# EasyEDA Pro project stm32g474.epro

# Schematic Schematic1
Assembly Variant: Basic; Board Name: Board1; Create Date: 2025-12-02; Page Name: P1; Project Name: New Project_2025-12-02_14-17-57; Schematic Name: Schematic1; Update Date: 2025-12-02; BladeWidth: 10; Company: 嘉立创EDA; Page Size: A4; RegionStart: 1; ShowBorder: 1; TitleBlock: 1; TitleBlockPosition: 3; Version: V1.0; XRegionCount: 6; YRegionCount: 4
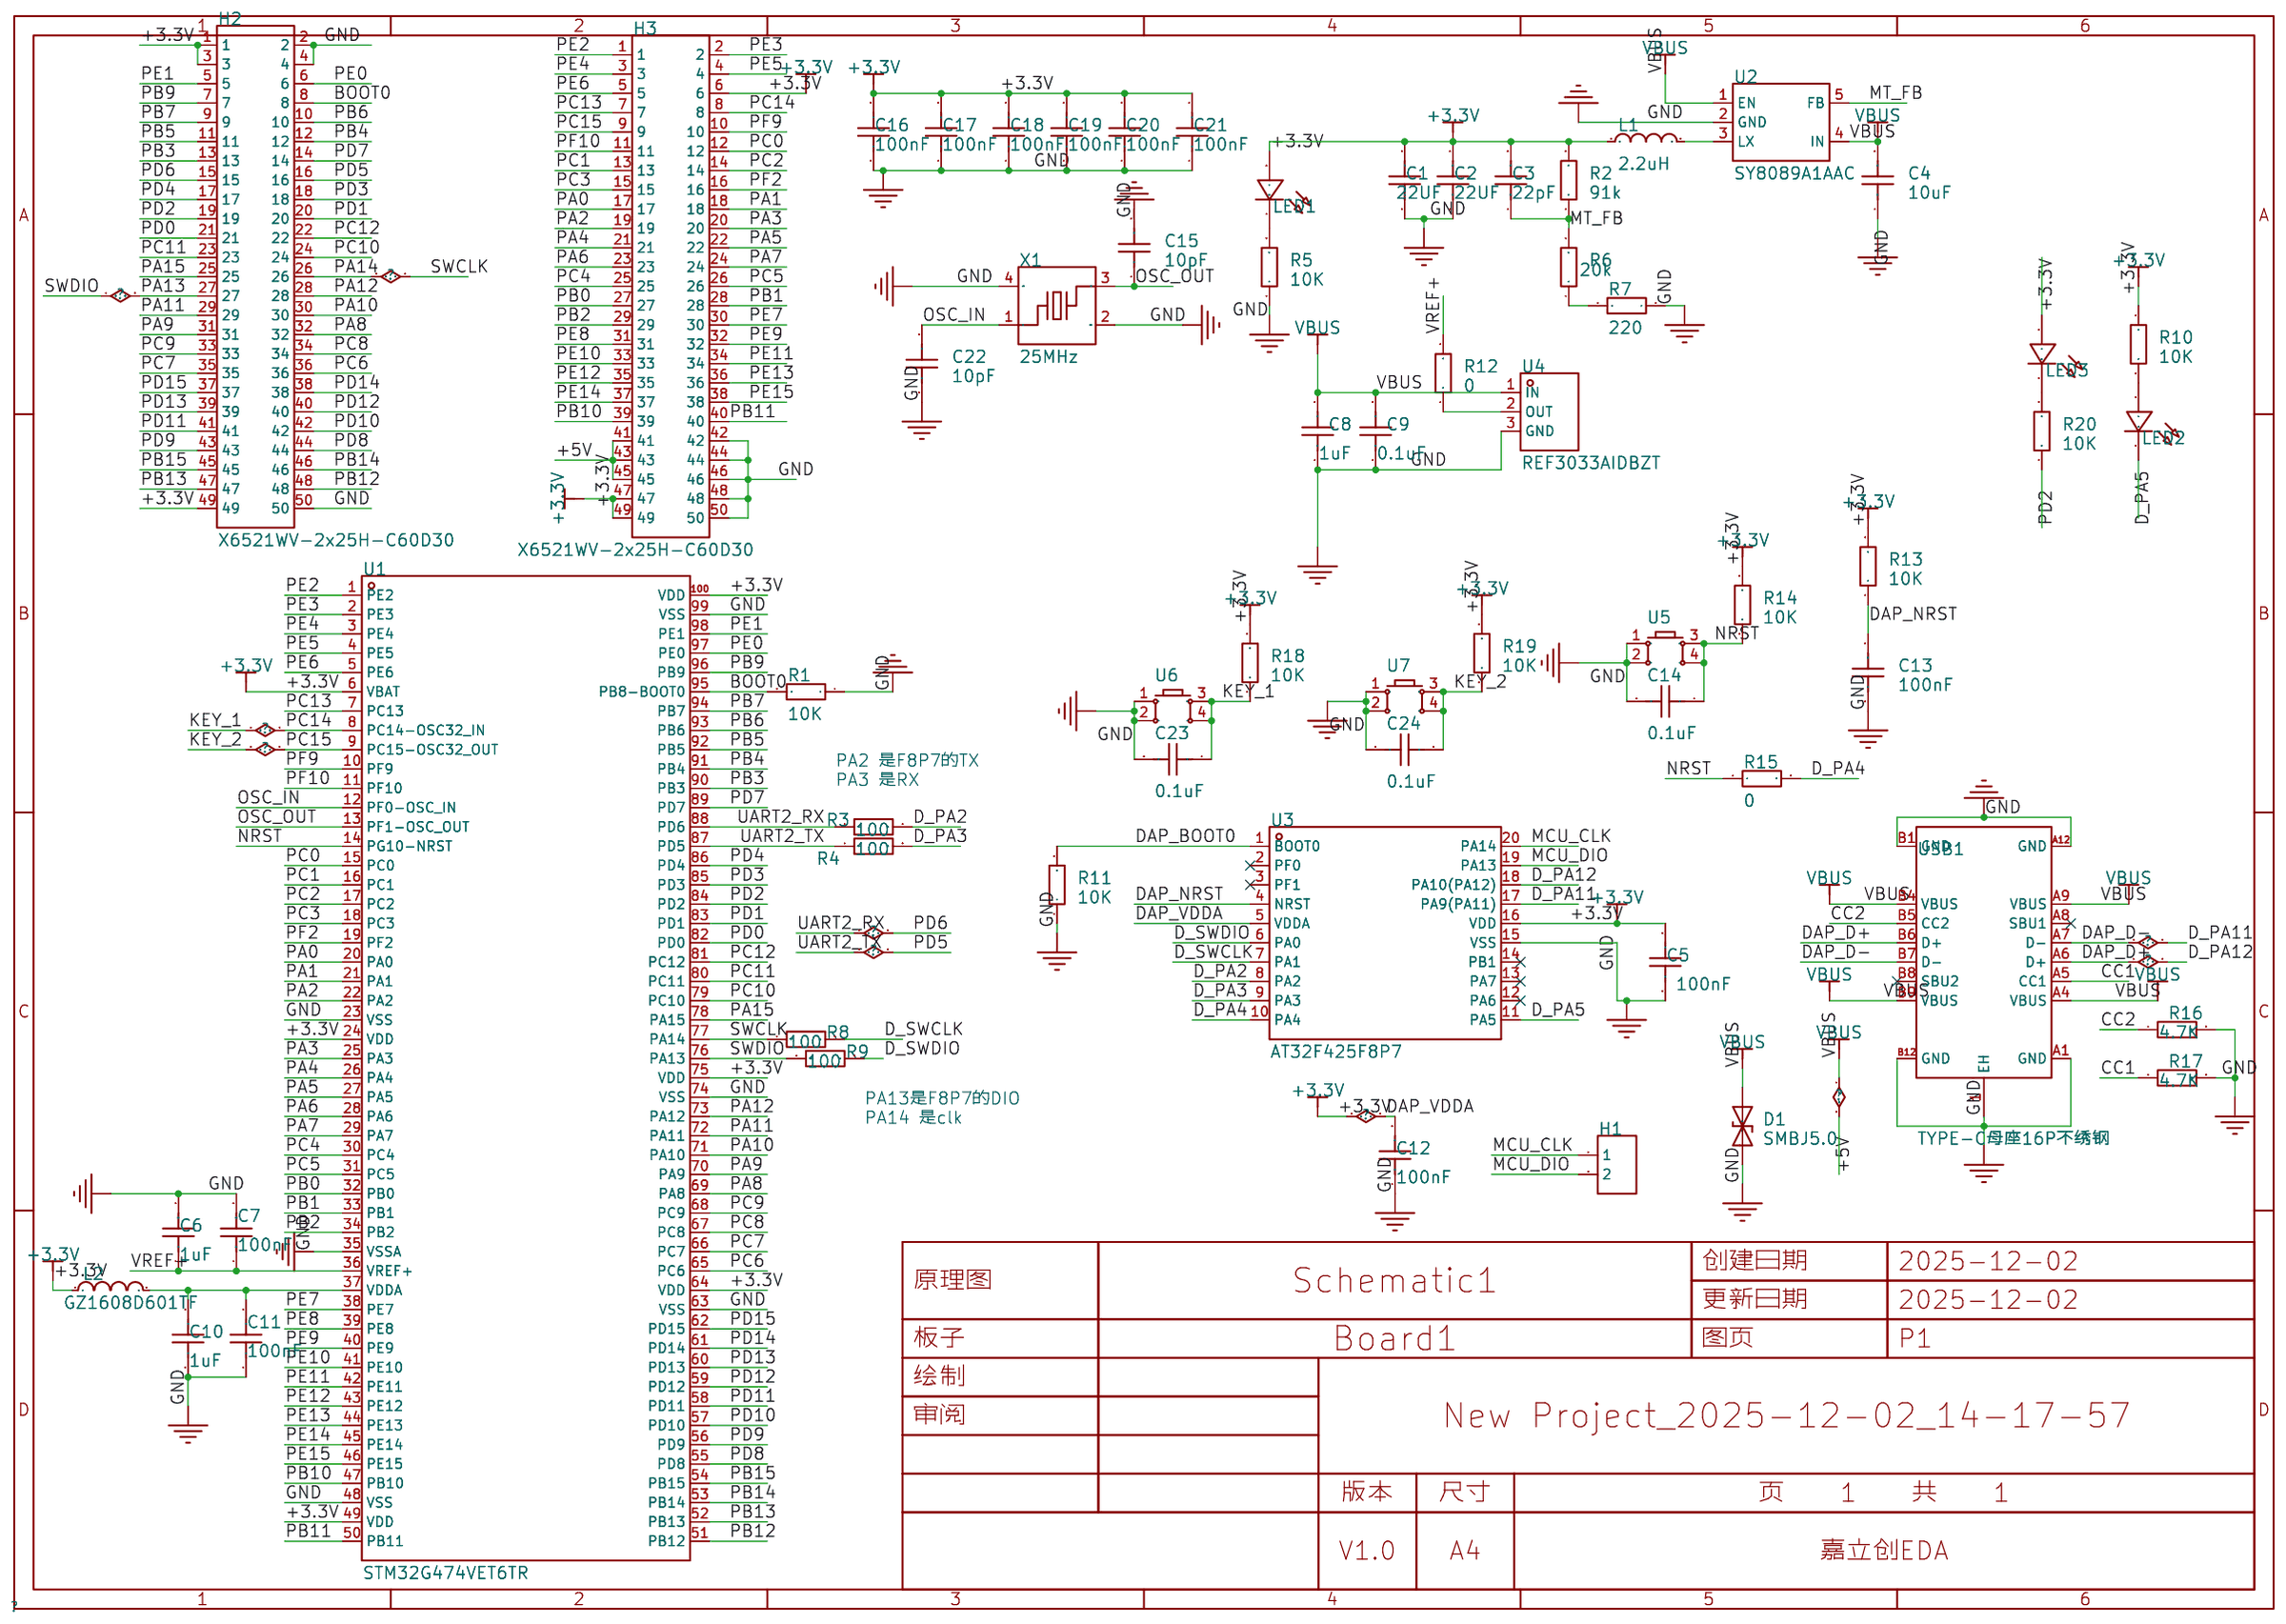
[diagram p0: schematic sheet]

## Parts
C1  22UF  [C0603_1]
C2  22UF  [C0603_1]
C3  22pF  [C0603_1]
C4  10uF  [C0603_1]
C5  100nF  [C0603_1]
C6  1uF  [C0603_1]
C7  100nF  [C0603_1]
C8  1uF  [C0603_1]
C9  0.1uF  [C0603_1]
C10  1uF  [C0603_1]
C11  100nF  [C0603_1]
C12  100nF  [C0603_1]
C13  100nF  [C0603_1]
C14  0.1uF  [C0603_1]
C15  10pF  [C0603_1]
C16  100nF  [C0603_1]
C17  100nF  [C0603_1]
C18  100nF  [C0603_1]
C19  100nF  [C0603_1]
C20  100nF  [C0603_1]
C21  100nF  [C0603_1]
C22  10pF  [C0603_1]
C23  0.1uF  [C0603_1]
C24  0.1uF  [C0603_1]
D1  SMBJ5.0  [SMB_L4.3-W3.6-LS5.4-BI]
H1  -  [HDR-TH_2P-P2.54-V-F]
H2  X6521WV-2x25H-C60D30  [HDR-TH_50P-2.54-V-M-R2-C25-S2.54]
H3  X6521WV-2x25H-C60D30  [HDR-TH_50P-2.54-V-M-R2-C25-S2.54]
L1  2.2uH  [IND-SMD_L2.5-W2.0_MHCHL2520]
L2  GZ1608D601TF  [L0603]
LED1  -  [LED_0603]
LED2  -  [LED_0603]
LED3  -  [LED_0603]
R1  10K  [R0603_1]
R2  91k  [R0603_1]
R3  100  [R0603_1]
R4  100  [R0603_1]
R5  10K  [R0603_1]
R6  20k  [R0603_1]
R7  220  [R0603_1]
R8  100  [R0603_1]
R9  100  [R0603_1]
R10  10K  [R0603_1]
R11  10K  [R0603_1]
R12  0  [R0603_1]
R13  10K  [R0603_1]
R14  10K  [R0603_1]
R15  0  [R0603_1]
R16  4.7K  [R0603_1]
R17  4.7K  [R0603_1]
R18  10K  [R0603_1]
R19  10K  [R0603_1]
R20  10K  [R0603_1]
U1  STM32G474VET6TR  [LQFP-100_L14.0-W14.0-P0.50-LS16.0-TL]
U2  SY8089A1AAC  [TSOT-23-5_L2.9-W1.6-P0.95-LS2.8-BR]
U3  AT32F425F8P7  [TSSOP-20_L6.5-W4.4-P0.65-LS6.4-BL]
U4  REF3033AIDBZT  [SOT-23-3_L2.9-W1.3-P1.90-LS2.4-BR_1]
U5  -  [SW-SMD_4P-L4.2-W3.4-P2.15-LS5.2]
U6  -  [SW-SMD_4P-L4.2-W3.4-P2.15-LS5.2]
U7  -  [SW-SMD_4P-L4.2-W3.4-P2.15-LS5.2]
USB1  TYPE-C母座16P不绣钢  [TYPE-C-SMD_16P-EH4]
X1  25MHz  [CRYSTAL-SMD_4P-L3.2-W2.5-BL]

## Library data of the parts
C1-C24 = CAP_0603: Supplier Footprint: 0603
D1 = SMBJ5.0: 反向截止电压(Vrwm):5V;钳位电压:9.6V;峰值脉冲电流(Ipp):62.5A;峰值脉冲功率(Ppp):600W;击穿电压:6.4V;; LCSC Part Name: TVS 5V截止 62.5A峰值脉冲; Supplier Part: C3699966; Manufacturer: Meritek; Supplier Footprint: DO-214AA(SMB); Datasheet: https://atta.szlcsc.com/upload/public/pdf/source/20240124/F48BA0542F6F34AEB83E4D8FD697F3E7.pdf; Supplier: LCSC; Reverse Stand-Off Voltage (Vrwm): 5V; Clamping Voltage: 9.6V; Peak Pulse Current (Ipp): 62.5A; Peak Pulse Power Dissipation (Ppp): 600W; Voltage - Breakdown: 6.4V; Type: TVS
H1 = HDR-F_2.54_1x2P: Supplier Part: C49661; Supplier Footprint: 插件
H2 H3 = X6521WV-2x25H-C60D30: 插针结构:2x25P;间距:2.54mm;行距:2.54mm;圆针/方针:方针;排数:双排;总PIN位数:50P;额定电流:3A;额定电压:250V;配合针长度:-;塑高:2.5mm;端接针长度:-;触头材质:黄铜;触头镀层:金;工作温度:-40℃~+105℃;颜色:黑色;; LCSC Part Name: 2x25P 间距:2.54mm 方针; Supplier Part: C725897; Manufacturer: XKB Connection(中国星坤); Supplier Footprint: 插件,P=2.54mm; JLCPCB Part Class: 扩展库; Datasheet: https://item.szlcsc.com/datasheet/X6521WV-2x25H-C60D30/772346.html; Supplier: LCSC; Pin Structure: 2x25P; Pitch: 2.54mm; Row Spacing: 2.54mm; Circluar Pins/Square Pins: 方针; Number of Rows: 双排; Number of Pins: 50P; Current Rating: 3A; Voltage Rating (Max): 250V; Insulation Height: 2.5mm; Contact Material: 黄铜; Contact Plating: 金; Operating Temperature: -40℃~+105℃; Color: 黑色
L1 = FTC252012S2R2MBCA: 电感值:2.2uH;精度:±20%;额定电流:3A;饱和电流(Isat):3.8A;类型:一体成型电感;; LCSC Part Name: 2.2uH ±20% 3.8A; Supplier Part: C5832372; Manufacturer: cjiang(长江微电); Supplier Footprint: 1008; JLCPCB Part Class: 扩展库; Datasheet: https://atta.szlcsc.com/upload/public/pdf/source/20230602/8FFEDA9C0247A92A0D4B67554BFE4091.pdf; Supplier: LCSC; Tolerance: ±20%; Rated Current: 3A; Saturation Current (Isat): 3.8A; DC Resistance (DCR): 55mΩ; Type: 一体成型电感
L2 = GZ1608D601TF: 阻抗 @ 频率:600Ω@100MHz;误差:±25%;直流电阻(DCR):450mΩ;; LCSC Part Name: 单路 0603磁珠 阻抗600Ω@100MHz; Supplier Part: C1002; Manufacturer: Sunlord(顺络); Supplier Footprint: 0603; JLCPCB Part Class: 基础库; Datasheet: https://atta.szlcsc.com/upload/public/pdf/source/20241120/893429B990C3BA07384E734821D2F218.pdf; Supplier: LCSC; Impedance @ Frequency: 600Ω@100MHz; Tolerance: ±25%; DC Resistance: 450mΩ; Current Rating: 200mA; Circuits: 1
LED1-LED3 = LED_0603-R: Supplier Footprint: 0603
R1-R20 = Res_0603: Supplier Footprint: 0603
U1 = STM32G474VET6TR: CPU内核:ARM-M系列;CPU最大主频:170MHz;应用领域:-;; LCSC Part Name: 带DSP和FPU的170MHz主流ARM Cortex-M4 MCU，具有512 KB Flash存储器、数学加速器、高分辨率定时器和高模拟电平集成; Supplier Part: C1857438; Manufacturer: ST(意法半导体); Supplier Footprint: LQFP-100(14x14); JLCPCB Part Class: 扩展库; Datasheet: https://atta.szlcsc.com/upload/public/pdf/source/20210601/070C5CED5EB45737871E6667B39F1293.pdf; Supplier: LCSC; CPU Core: ARM-M系列; CPU Maximum Speed: 170MHz; Program Storage Size: 512KB; Program Memory Type: FLASH; Number of I/O: 86; ADC (Bit): 12bit; DAC (Bit): 12bit; Voltage - Supply: 1.71V~3.6V
U2 = SY8089A1AAC: 功能类型:降压型;工作电压:2.5V~5.5V;输出电压:-;输出电流:2A;输出类型:可调;; LCSC Part Name: 高效1.5MHz 2A同步降压调节器; Supplier Part: C479074; Manufacturer: Silergy(矽力杰); Supplier Footprint: SOT-23-5; JLCPCB Part Class: 扩展库; Datasheet: https://item.szlcsc.com/datasheet/SY8089A1AAC/486366.html; Supplier: LCSC; Function: 降压型; Voltage - Supply: 2.5V~5.5V; Output Current: 2A; Frequency - Switching: 1.5MHz; Operating Temperature: -40℃~+125℃@(TA/TJ); Synchronous Rectifier: 是; Number of Outputs: 1; Topology: 降压式; Quiescent Current: 50uA; Switch tube (built-in/external): 内置; Output Type: 可调
U3 = AT32F425F8P7: 配有32 K字节到64 K字节闪存、sLib、1个CAN、1个OTGFS、13个定时器、1个ADC、12个通信接口。; LCSC Part Name: 基于ARM 32位Cortex - M4微控制器，配有闪存、sLib、CAN、OTGFS、定时器、ADC、通信接口; Supplier Part: C4153157; Manufacturer: ARTERY(雅特力); Supplier Footprint: TSSOP-20; JLCPCB Part Class: 扩展库; Datasheet: https://item.szlcsc.com/datasheet/AT32F425F8P7/4722606.html; Supplier: LCSC
U4 = REF3033AIDBZT: 输出类型:固定;工作电压:3.35V~5.5V;输出电压:3.3V;输出电流:25mA;精度:±0.2%;; LCSC Part Name: 采用SOT-23-3封装的CMOS电压基准; Supplier Part: C2872391; Manufacturer: TI(德州仪器); Supplier Footprint: SOT-23-3; JLCPCB Part Class: 扩展库; Datasheet: https://www.ti.com/cn/lit/gpn/ref3012; Supplier: LCSC; Output Type: 固定; Voltage - Supply: 3.35V~5.5V; Output Voltage: 3.3V; Output Current: 25mA; Tolerance: ±0.2%; Temperature Coefficient: 75ppm/℃; Reference Type: 串联; Quiescent Current: 42uA; Noise - 1/10Hz to 10Hz: 36uVp-p; Noise - 10Hz to 10kHz: 105uVrms; Operating Temperature: -40℃~+125℃
U5-U7 = Key_SMD_3x4x2.5
USB1 = TYPE-C母座16P不绣钢: Supplier Part: C9900003726; Supplier Footprint: TYPE-C-SMD_16P-L8.94-W7.35-P0.50; JLCPCB Part Class: Extended Part; Supplier: LCSC
X1 = XL2EL89CSI-111YLC-25M: 晶振类型:贴片晶振;频率:25MHz;常温频差:±10ppm;负载电容:20pF;频率稳定度:±20ppm;; LCSC Part Name: YSX321SL 25MHZ 4P 3225 20PF ±10PPM -40~85℃ (±20PPM); Supplier Part: C5280577; Manufacturer: YXC(扬兴晶振); Supplier Footprint: SMD3225-4P; JLCPCB Part Class: 扩展库; Datasheet: https://item.szlcsc.com/datasheet/XL2EL89CSI-111YLC-25M/6016759.html; Supplier: LCSC; Type: 贴片晶振; Normal temperature Frequency Tolerance: ±10ppm; Load Capacitance: 20pF; Frequency Stability: ±20ppm; Operating Temperature: -40℃~+85℃

## Nets
+3.3V: C1.2 C2.2 C3.2 C5.2 C12.2 C16.2 C17.2 C18.2 C19.2 C20.2 C21.2 H2.1 H2.3 H2.49 H3.6 H3.47 H3.49 L1.1 L2.1 LED1.2(A) LED3.2(A) R2.2 R10.1 R13.2 R14.2 R18.2 R19.2 U1.6(VBAT) U1.24(VDD) U1.49(VDD) U1.64(VDD) U1.75(VDD) U1.100(VDD) U3.5(VDDA) U3.16(VDD)
GND: C1.1 C2.1 C4.1 C5.1 C6.2 C7.2 C8.1 C9.1 C10.1 C11.1 C12.1 C13.1 C14.2 C15.2 C16.1 C17.1 C18.1 C19.1 C20.1 C21.1 C22.1 C23.2 C24.2 D1.2(A1) H2.2 H2.4 H2.50 H3.42 H3.44 H3.46 H3.48 H3.50 R1.1 R5.1 R7.1 R11.1 R16.2 R17.2 U1.23(VSS) U1.35(VSSA) U1.48(VSS) U1.63(VSS) U1.74(VSS) U1.99(VSS) U2.2(GND) U3.15(VSS) U4.3(GND) U5.1 U5.2 U6.1 U6.2 U7.1 U7.2 USB1.1(EH) USB1.A1(GND) USB1.A12(GND) USB1.B1(GND) USB1.B12(GND) X1.2(GND) X1.4(GND)
VBUS: C4.2 C8.2 C9.2 D1.1(A2) H3.41 H3.43 H3.45 U2.1(EN) U2.4(IN) U4.1(IN) USB1.A4(VBUS) USB1.A9(VBUS) USB1.B4(VBUS) USB1.B9(VBUS)
BOOT0: H2.8 R1.2 U1.95(PB8-BOOT0)
CC1: R17.1 USB1.A5(CC1)
CC2: R16.1 USB1.B5(CC2)
D_PA2: R3.2 U3.8(PA2)
D_PA3: R4.2 U3.9(PA3)
D_PA4: R15.2 U3.10(PA4)
D_PA5: LED2.1(C) U3.11(PA5)
D_SWCLK: R8.2 U3.7(PA1)
D_SWDIO: R9.2 U3.6(PA0)
DAP_BOOT0: R11.2 U3.1(BOOT0)
DAP_D+: U3.18(PA10(PA12)) USB1.A6(D+) USB1.B6(D+)
DAP_D-: U3.17(PA9(PA11)) USB1.A7(D-) USB1.B7(D-)
DAP_NRST: C13.2 R13.1 U3.4(NRST)
KEY_1: C23.1 H3.8 R18.1 U1.8(PC14-OSC32_IN) U6.3 U6.4
KEY_2: C24.1 H3.9 R19.1 U1.9(PC15-OSC32_OUT) U7.3 U7.4
MCU_CLK: H1.1 U3.20(PA14)
MCU_DIO: H1.2 U3.19(PA13)
MT_FB: C3.1 R2.1 R6.2 U2.5(FB)
NRST: C14.1 R14.1 R15.1 U1.14(PG10-NRST) U5.3 U5.4
OSC_IN: C22.2 U1.12(PF0-OSC_IN) X1.1
OSC_OUT: C15.1 U1.13(PF1-OSC_OUT) X1.3
PA0: H3.17 U1.20(PA0)
PA1: H3.18 U1.21(PA1)
PA2: H3.19 U1.22(PA2)
PA3: H3.20 U1.25(PA3)
PA4: H3.21 U1.26(PA4)
PA5: H3.22 U1.27(PA5)
PA6: H3.23 U1.28(PA6)
PA7: H3.24 U1.29(PA7)
PA8: H2.32 U1.69(PA8)
PA9: H2.31 U1.70(PA9)
PA10: H2.30 U1.71(PA10)
PA11: H2.29 U1.72(PA11)
PA12: H2.28 U1.73(PA12)
PA13: H2.27 R9.1 U1.76(PA13)
PA14: H2.26 R8.1 U1.77(PA14)
PA15: H2.25 U1.78(PA15)
PB0: H3.27 U1.32(PB0)
PB1: H3.28 U1.33(PB1)
PB2: H3.29 U1.34(PB2)
PB3: H2.13 U1.90(PB3)
PB4: H2.12 U1.91(PB4)
PB5: H2.11 U1.92(PB5)
PB6: H2.10 U1.93(PB6)
PB7: H2.9 U1.94(PB7)
PB9: H2.7 U1.96(PB9)
PB10: H3.39 U1.47(PB10)
PB11: H3.40 U1.50(PB11)
PB12: H2.48 U1.51(PB12)
PB13: H2.47 U1.52(PB13)
PB14: H2.46 U1.53(PB14)
PB15: H2.45 U1.54(PB15)
PC0: H3.12 U1.15(PC0)
PC1: H3.13 U1.16(PC1)
PC2: H3.14 U1.17(PC2)
PC3: H3.15 U1.18(PC3)
PC4: H3.25 U1.30(PC4)
PC5: H3.26 U1.31(PC5)
PC6: H2.36 U1.65(PC6)
PC7: H2.35 U1.66(PC7)
PC8: H2.34 U1.67(PC8)
PC9: H2.33 U1.68(PC9)
PC10: H2.24 U1.79(PC10)
PC11: H2.23 U1.80(PC11)
PC12: H2.22 U1.81(PC12)
PC13: H3.7 U1.7(PC13)
PD0: H2.21 U1.82(PD0)
PD1: H2.20 U1.83(PD1)
PD2: H2.19 R20.1 U1.84(PD2)
PD3: H2.18 U1.85(PD3)
PD4: H2.17 U1.86(PD4)
PD5: H2.16 R4.1 U1.87(PD5)
PD6: H2.15 R3.1 U1.88(PD6)
PD7: H2.14 U1.89(PD7)
PD8: H2.44 U1.55(PD8)
PD9: H2.43 U1.56(PD9)
PD10: H2.42 U1.57(PD10)
PD11: H2.41 U1.58(PD11)
PD12: H2.40 U1.59(PD12)
PD13: H2.39 U1.60(PD13)
PD14: H2.38 U1.61(PD14)
PD15: H2.37 U1.62(PD15)
PE0: H2.6 U1.97(PE0)
PE1: H2.5 U1.98(PE1)
PE2: H3.1 U1.1(PE2)
PE3: H3.2 U1.2(PE3)
PE4: H3.3 U1.3(PE4)
PE5: H3.4 U1.4(PE5)
PE6: H3.5 U1.5(PE6)
PE7: H3.30 U1.38(PE7)
PE8: H3.31 U1.39(PE8)
PE9: H3.32 U1.40(PE9)
PE10: H3.33 U1.41(PE10)
PE11: H3.34 U1.42(PE11)
PE12: H3.35 U1.43(PE12)
PE13: H3.36 U1.44(PE13)
PE14: H3.37 U1.45(PE14)
PE15: H3.38 U1.46(PE15)
PF2: H3.16 U1.19(PF2)
PF9: H3.10 U1.10(PF9)
PF10: H3.11 U1.11(PF10)
VREF+: C6.1 C7.1 R12.2 U1.36(VREF+)
$1N1911: LED1.1(C) R5.2
$1N1933: LED2.2(A) R10.2
$1N2083: R12.1 U4.2(OUT)
$1N2090: C10.2 C11.2 L2.2 U1.37(VDDA)
$1N10377: L1.2 U2.3(LX)
$1N10666: R6.1 R7.2
Net-(LED3-1): LED3.1(C) R20.2

Not connected (* = marked no-connect by the designer): U3 2(PF0)* 3(PF1)* 12(PA6)* 13(PA7)* 14(PB1)*; USB1 A8(SBU1)* B8(SBU2)*

## Notes on the sheet
- PA2 是F8P7的TX
  PA3 是RX
- PA13是F8P7的DIO
  PA14 是clk

# Board PCB1
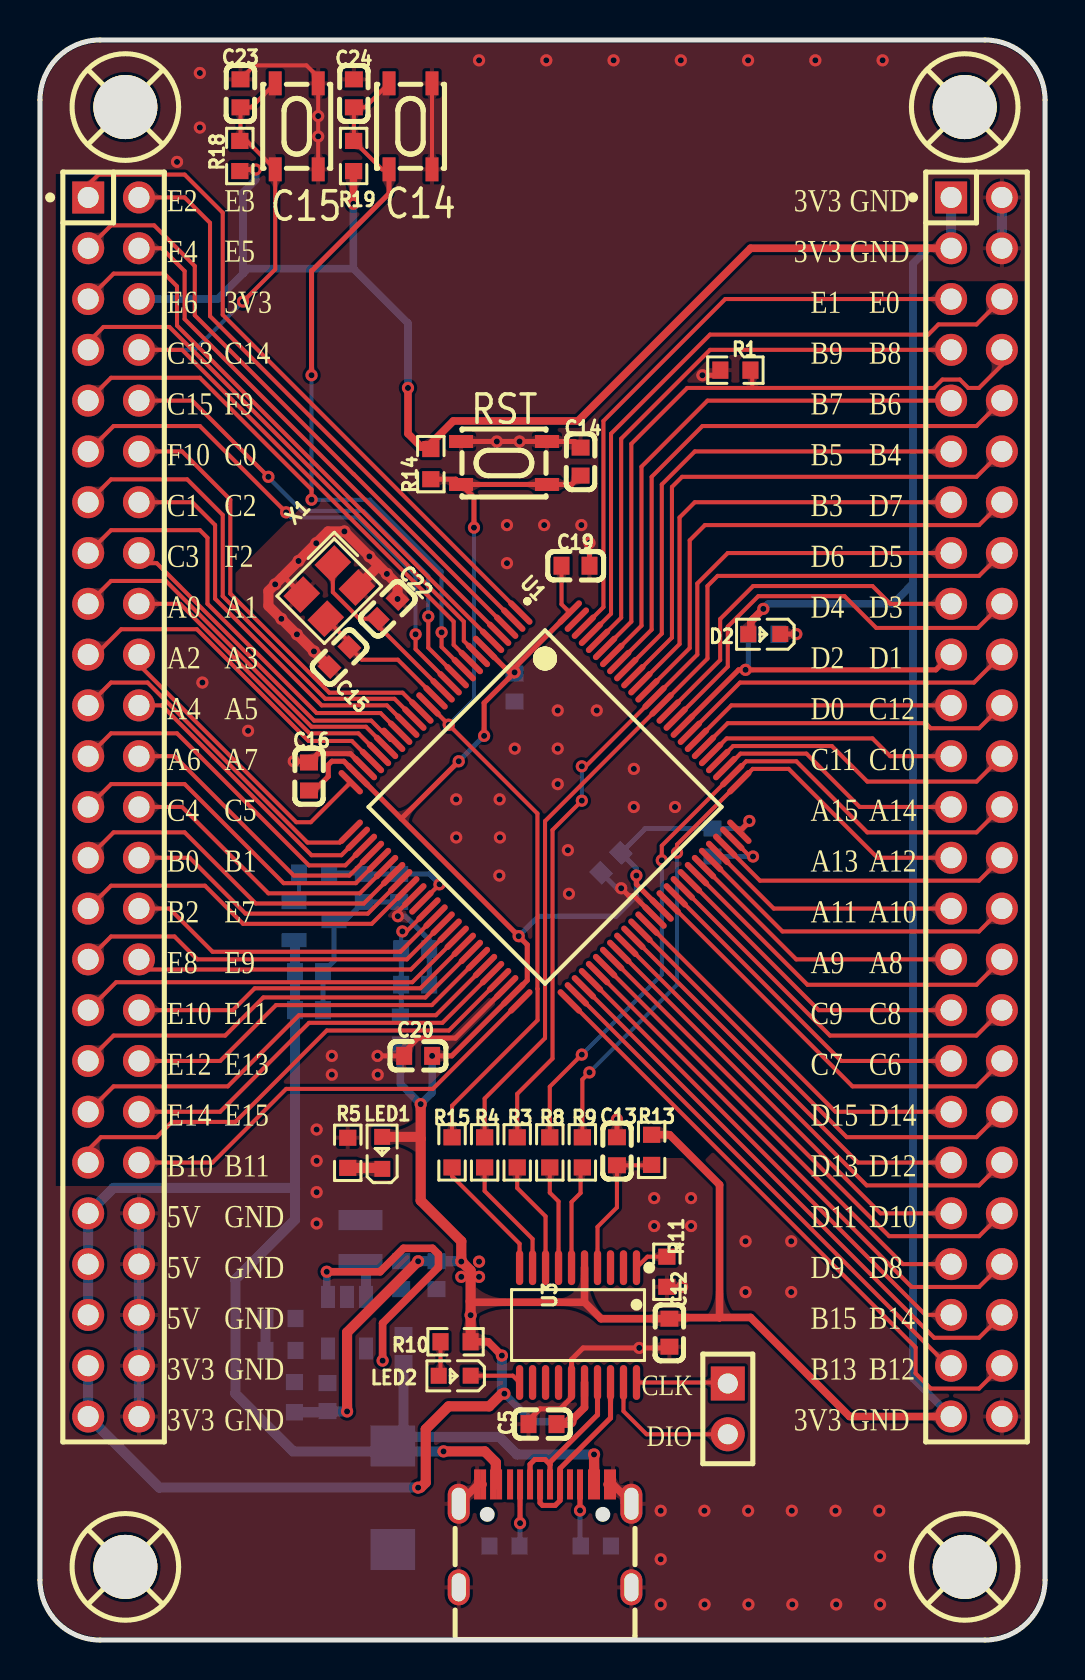
[diagram p1: board, top side]
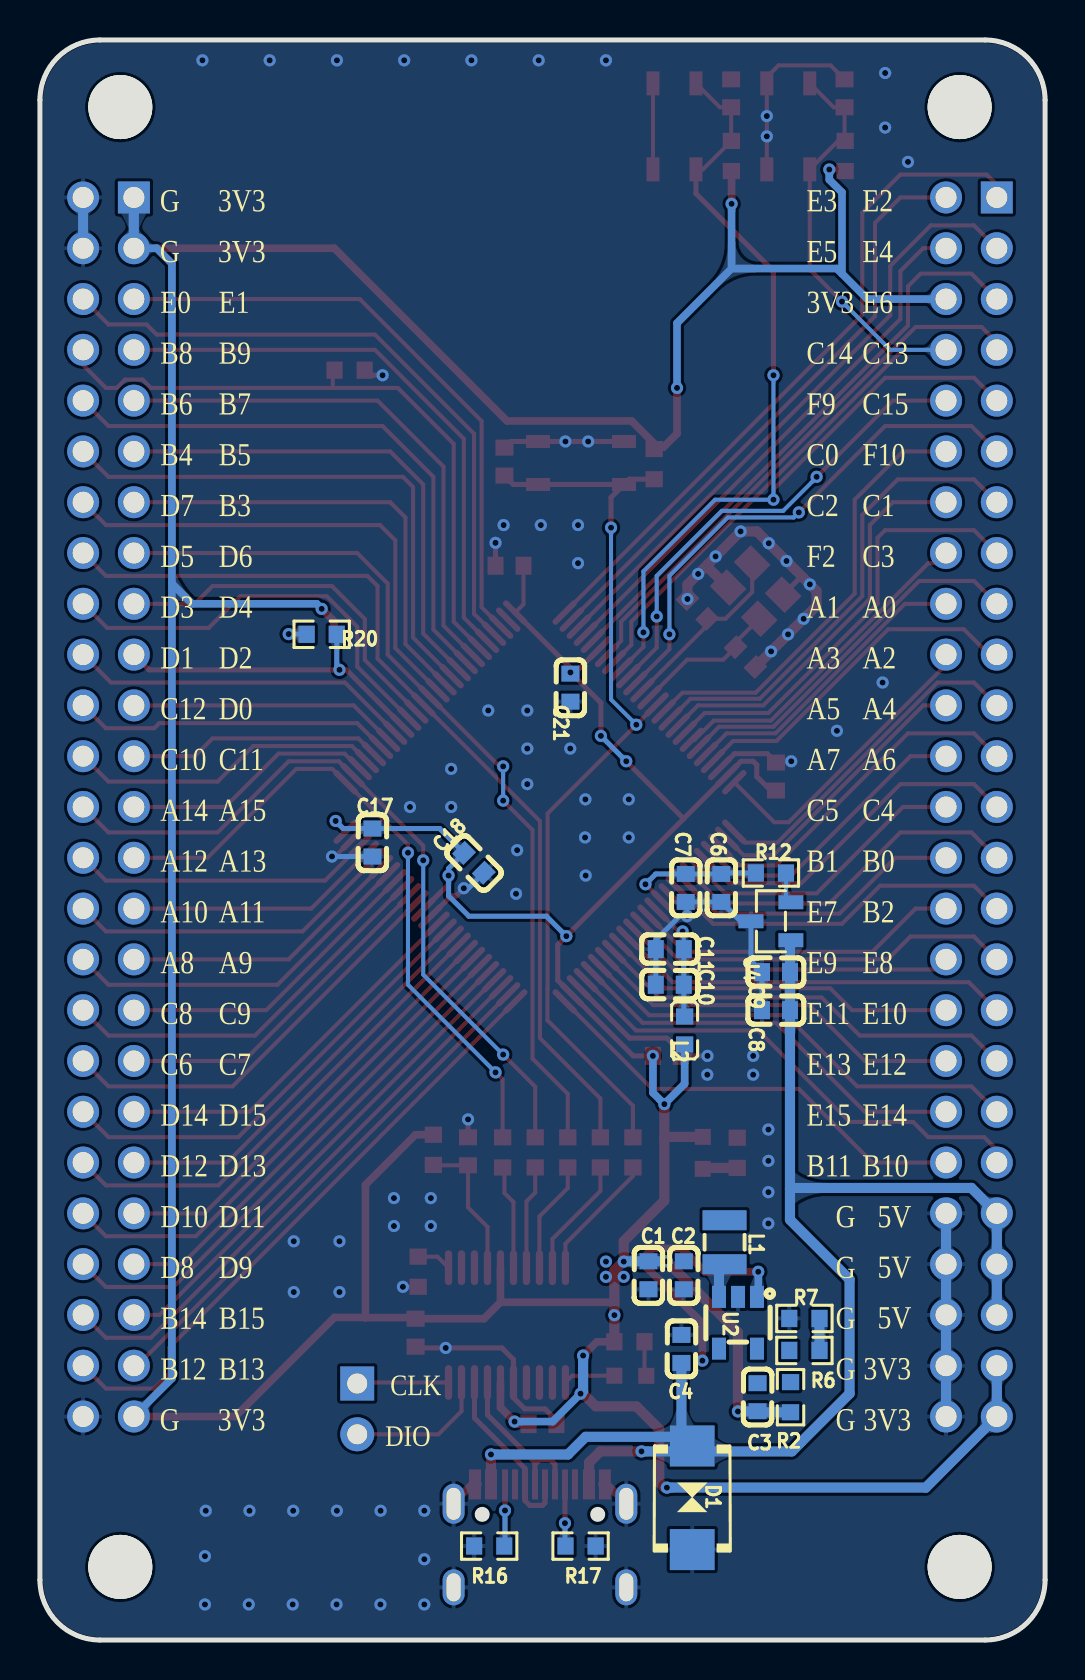
[diagram p2: board, bottom side, seen from below]

Outline 50.29 x 80.01 mm; copper layers: Top Layer, Bottom Layer. Coordinates in mm from the lower left corner of the outline.
Outline path: 0,77.01 0,3 arc(0.88,0.88) 3,0 47.29,0 arc(49.41,0.88) 50.29,3 50.29,77.01 arc(49.41,79.13) 47.29,80.01 3,80.01 arc(0.88,79.13) 0,77.01
Stack: Top Layer 0.035mm / Dielectric1 1.51mm FR4 er 4.5 / Bottom Layer 0.035mm

## Design rules (mm)
spacing copperThickness1oz (default): track to track 0.102, other pairs 0.152 to 0.3
spacing copperThickness2oz: track to track 0.203, other pairs 0.152 to 0.3
track width copperThickness1oz (default): min 0.127, default 0.254, max 2.54
track width copperThickness2oz: min 0.203, default 0.254, max 2.54
differential pair differentialPair (default): width min 0.127, default 0.254, max 2.54; gap min 0.152, default 0.152
net GND uses copperRegion

## Placement (name value [footprint] x y rotation side)
C1  22UF  [C0603_1]  19.85 18.24 90 bottom
C2  22UF  [C0603_1]  18.07 18.24 90 bottom
C3  22pF  [C0603_1]  14.38 12.14 270 bottom
C4  10uF  [C0603_1]  18.19 14.56 270 bottom
C5  100nF  [C0603_1]  25.15 10.79 0 top
C6  1uF  [C0603_1]  16.2 37.61 270 bottom
C7  100nF  [C0603_1]  17.98 37.61 270 bottom
C8  1uF  [C0603_1]  13.46 31.5 180 bottom
C9  0.1uF  [C0603_1]  13.46 33.4 180 bottom
C10  1uF  [C0603_1]  18.78 32.77 180 bottom
C11  100nF  [C0603_1]  18.78 34.55 180 bottom
C12  100nF  [C0603_1]  31.5 15.37 90 top
C13  100nF  [C0603_1]  28.87 24.44 270 top
C14  0.1uF  [C0603_1]  27.05 58.93 90 top
C15  10pF  [C0603_1]  14.99 49.15 225 top
C16  100nF  [C0603_1]  13.46 43.18 270 top
C17  100nF  [C0603_1]  33.66 39.88 90 bottom
C18  100nF  [C0603_1]  28.57 38.86 45 bottom
C19  100nF  [C0603_1]  26.8 53.72 180 top
C20  100nF  [C0603_1]  18.92 29.21 0 top
C21  100nF  [C0603_1]  23.75 47.62 90 bottom
C22  10pF  [C0603_1]  17.4 51.56 225 top
C23  0.1uF  [C0603_1]  10.03 77.34 90 top
C24  0.1uF  [C0603_1]  15.71 77.34 90 top
D1  SMBJ5.0  [SMB_L4.3-W3.6-LS5.4-BI]  17.65 7.11 270 bottom
D2  -  [LED_0603]  36.19 50.29 180 top
H1  -  [HDR-TH_2P-P2.54-V-F]  34.42 11.56 270 top
H2  X6521WV-2x25H-C60D30  [HDR-TH_50P-2.54-V-M-R2-C25-S2.54]  46.86 41.66 270 top
H3  X6521WV-2x25H-C60D30  [HDR-TH_50P-2.54-V-M-R2-C25-S2.54]  3.68 41.66 270 top
L1  2.2uH  [IND-SMD_L2.5-W2.0_MHCHL2520]  16.04 19.89 270 bottom
L2  GZ1608D601TF  [L0603]  18.03 30.48 90 bottom
LED1  -  [LED_0603]  17.12 24.41 90 top
LED2  -  [LED_0603]  20.7 13.21 180 top
R1  10K  [R0603_1]  34.8 63.5 0 top
R2  91k  [R0603_1]  12.73 12.14 270 bottom
R3  100  [R0603_1]  23.88 24.38 270 top
R4  100  [R0603_1]  22.25 24.38 270 top
R5  10K  [R0603_1]  15.4 24.36 270 top
R6  20k  [R0603_1]  12.04 14.48 0 bottom
R7  220  [R0603_1]  12.04 16.08 180 bottom
R8  100  [R0603_1]  25.51 24.38 270 top
R9  100  [R0603_1]  27.14 24.38 270 top
R10  10K  [R0603_1]  20.8 14.91 180 top
R11  10K  [R0603_1]  31.37 18.41 90 top
R12  0  [R0603_1]  13.72 38.35 0 bottom
R13  10K  [R0603_1]  30.61 24.51 90 top
R14  10K  [R0603_1]  19.56 58.8 90 top
R15  0  [R0603_1]  20.62 24.38 270 top
R16  4.7K  [R0603_1]  27.81 4.7 0 bottom
R17  4.7K  [R0603_1]  23.24 4.7 180 bottom
R18  10K  [R0603_1]  10 74.21 270 top
R19  10K  [R0603_1]  15.69 74.21 270 top
R20  10K  [R0603_1]  36.19 50.29 0 bottom
SCREW1  -  [M3螺丝]  4.27 76.66 0 top
SCREW2  -  [M3螺丝]  4.27 3.66 0 top
SCREW3  -  [M3螺丝]  46.27 3.66 0 top
SCREW4  -  [M3螺丝]  46.27 76.66 0 top
U1  STM32G474VET6TR  [LQFP-100_L14.0-W14.0-P0.50-LS16.0-TL]  25.27 41.66 315 top
U2  SY8089A1AAC  [TSOT-23-5_L2.9-W1.6-P0.95-LS2.8-BR]  15.36 15.86 90 bottom
U3  AT32F425F8P7  [TSSOP-20_L6.5-W4.4-P0.65-LS6.4-BL]  26.92 15.75 180 top
U4  REF3033AIDBZT  [SOT-23-3_L2.9-W1.3-P1.90-LS2.4-BR_1]  13.72 35.94 180 bottom
U5  -  [SW-SMD_4P-L4.2-W3.4-P2.15-LS5.2]  23.22 58.86 0 top
U6  -  [SW-SMD_4P-L4.2-W3.4-P2.15-LS5.2]  12.85 75.69 270 top
U7  -  [SW-SMD_4P-L4.2-W3.4-P2.15-LS5.2]  18.54 75.69 270 top
USB1  TYPE-C母座16P不绣钢  [TYPE-C-SMD_16P-EH4]  25.27 5.21 0 top
X1  25MHz  [CRYSTAL-SMD_4P-L3.2-W2.5-BL]  14.48 52.45 225 top

## Footprints (pads in the part's own frame, mm; a bottom-side part is the same pattern mirrored in y, then rotated)
C0603_1
  rect 0.8x0.9 smd: 1(-0.7,0) 2(0.7,0)
CRYSTAL-SMD_4P-L3.2-W2.5-BL
  rect 1.4x1.2 smd: 1(-1.1,-0.85) 2(1.1,-0.85) 3(1.1,0.85) 4(-1.1,0.85)
HDR-TH_2P-P2.54-V-F
  rect 1.7x1.7 hole 1: 1(-1.27,0)
  round 1.7 hole 1: 2(1.27,0)
HDR-TH_50P-2.54-V-M-R2-C25-S2.54
  rect 1.6x1.6 hole 1.05: 1(-30.48,-1.27)
  round 1.6 hole 1.05: 2(-30.48,1.27) 3(-27.94,-1.27) 4(-27.94,1.27) 5(-25.4,-1.27) 6(-25.4,1.27) 7(-22.86,-1.27) 8(-22.86,1.27) 9(-20.32,-1.27) 10(-20.32,1.27) 11(-17.78,-1.27) 12(-17.78,1.27) 13(-15.24,-1.27) 14(-15.24,1.27) 15(-12.7,-1.27) 16(-12.7,1.27) 17(-10.16,-1.27) 18(-10.16,1.27) 19(-7.62,-1.27) 20(-7.62,1.27) 21(-5.08,-1.27) 22(-5.08,1.27) 23(-2.54,-1.27) 24(-2.54,1.27) 25(0,-1.27) 26(0,1.27) 27(2.54,-1.27) 28(2.54,1.27) 29(5.08,-1.27) 30(5.08,1.27) 31(7.62,-1.27) 32(7.62,1.27) 33(10.16,-1.27) 34(10.16,1.27) 35(12.7,-1.27) 36(12.7,1.27) 37(15.24,-1.27) 38(15.24,1.27) 39(17.78,-1.27) 40(17.78,1.27) 41(20.32,-1.27) 42(20.32,1.27) 43(22.86,-1.27) 44(22.86,1.27) 45(25.4,-1.27) 46(25.4,1.27) 47(27.94,-1.27) 48(27.94,1.27) 49(30.48,-1.27) 50(30.48,1.27)
IND-SMD_L2.5-W2.0_MHCHL2520
  rect 1x2.2 smd: 1(-1.1,0) 2(1.1,0)
L0603
  rect 0.8x0.864 smd: 1(-0.7,0) 2(0.7,0)
LED_0603
  rect 0.8x0.8 smd: 1(-0.851,-0.01) 2(0.75,-0.005)
LQFP-100_L14.0-W14.0-P0.50-LS16.0-TL
  oval 1.6x0.3 smd: 1(-7.75,6) 2(-7.75,5.5) 3(-7.75,5) 4(-7.75,4.5) 5(-7.75,4) 6(-7.75,3.5) 7(-7.75,3) 8(-7.75,2.5) 9(-7.75,2) 10(-7.75,1.5) 11(-7.75,1) 12(-7.75,0.5) 13(-7.75,0) 14(-7.75,-0.5) 15(-7.75,-1) 16(-7.75,-1.5) 17(-7.75,-2) 18(-7.75,-2.5) 19(-7.75,-3) 20(-7.75,-3.5) 21(-7.75,-4) 22(-7.75,-4.5) 23(-7.75,-5) 24(-7.75,-5.5) 25(-7.75,-6) 51(7.75,-6) 52(7.75,-5.5) 53(7.75,-5) 54(7.75,-4.5) 55(7.75,-4) 56(7.75,-3.5) 57(7.75,-3) 58(7.75,-2.5) 59(7.75,-2) 60(7.75,-1.5) 61(7.75,-1) 62(7.75,-0.5) 63(7.75,0) 64(7.75,0.5) 65(7.75,1) 66(7.75,1.5) 67(7.75,2) 68(7.75,2.5) 69(7.75,3) 70(7.75,3.5) 71(7.75,4) 72(7.75,4.5) 73(7.75,5) 74(7.75,5.5) 75(7.75,6)
  oval 0.3x1.6 smd: 26(-6,-7.75) 27(-5.5,-7.75) 28(-5,-7.75) 29(-4.5,-7.75) 30(-4,-7.75) 31(-3.5,-7.75) 32(-3,-7.75) 33(-2.5,-7.75) 34(-2,-7.75) 35(-1.5,-7.75) 36(-1,-7.75) 37(-0.5,-7.75) 38(0,-7.75) 39(0.5,-7.75) 40(1,-7.75) 41(1.5,-7.75) 42(2,-7.75) 43(2.5,-7.75) 44(3,-7.75) 45(3.5,-7.75) 46(4,-7.75) 47(4.5,-7.75) 48(5,-7.75) 49(5.5,-7.75) 50(6,-7.75) 76(6,7.75) 77(5.5,7.75) 78(5,7.75) 79(4.5,7.75) 80(4,7.75) 81(3.5,7.75) 82(3,7.75) 83(2.5,7.75) 84(2,7.75) 85(1.5,7.75) 86(1,7.75) 87(0.5,7.75) 88(0,7.75) 89(-0.5,7.75) 90(-1,7.75) 91(-1.5,7.75) 92(-2,7.75) 93(-2.5,7.75) 94(-3,7.75) 95(-3.5,7.75) 96(-4,7.75) 97(-4.5,7.75) 98(-5,7.75) 99(-5.5,7.75) 100(-6,7.75)
M3螺丝
  round 3.2 hole 3.2: 1(0,0)
R0603_1
  rect 0.806x0.864 smd: 1(-0.753,0) 2(0.753,0)
SMB_L4.3-W3.6-LS5.4-BI
  rect 2.047x2.241 smd: 1(-2.591,0) 2(2.591,0)
SOT-23-3_L2.9-W1.3-P1.90-LS2.4-BR_1
  rect 1.25x0.7 smd: 1(1,-0.95) 2(1,0.95) 3(-1,0)
SW-SMD_4P-L4.2-W3.4-P2.15-LS5.2
  rect 1.2x0.65 smd: 1(-2.15,1.075) 2(2.15,1.075) 3(-2.15,-1.075) 4(2.15,-1.075)
TSOT-23-5_L2.9-W1.6-P0.95-LS2.8-BR
  rect 1.1x0.7 smd: 1(1.294,-0.951) 2(1.294,-0.001) 3(1.294,0.951) 4(-1.294,0.951) 5(-1.294,-0.949)
TSSOP-20_L6.5-W4.4-P0.65-LS6.4-BL
  oval 0.364x1.742 smd: 1(-2.925,-2.871) 2(-2.275,-2.871) 3(-1.625,-2.871) 4(-0.975,-2.871) 5(-0.325,-2.871) 6(0.325,-2.871) 7(0.975,-2.871) 8(1.625,-2.871) 9(2.275,-2.871) 10(2.925,-2.871) 11(2.925,2.871) 12(2.275,2.871) 13(1.625,2.871) 14(0.975,2.871) 15(0.325,2.871) 16(-0.325,2.871) 17(-0.975,2.871) 18(-1.625,2.871) 19(-2.275,2.871) 20(-2.925,2.871)
TYPE-C-SMD_16P-EH4
  oval 1.1x2 hole 0.7x1.6: 1(-4.32,1.606) 1(4.32,1.606)
  oval 1.1x1.8 hole 0.7x1.4: 1(-4.32,-2.574) 1(4.32,-2.574)
  rect 0.3x1.5 smd: A1(-3.4,2.573) A4(-2.6,2.573) A5(-1.25,2.573) A6(-0.25,2.573) A7(0.25,2.573) A8(1.25,2.574) A9(2.6,2.574) A12(3.4,2.573) B1(3.1,2.573) B4(2.3,2.574) B5(1.75,2.573) B6(0.75,2.573) B7(-0.75,2.573) B8(-1.75,2.574) B9(-2.3,2.573) B12(-3.1,2.573)

## Nets
As in the schematic, except:
+3.3V: C1.2 C2.2 C3.2 C5.2 C12.2 C16.2 C17.2 C18.2 C19.2 C20.2 C21.2 D2.2 H2.1 H2.3 H2.49 H3.6 H3.47 H3.49 L1.1 L2.1 LED1.2 R2.2 R10.1 R13.2 R14.2 R18.2 R19.2 U1.6 U1.24 U1.49 U1.64 U1.75 U1.100 U3.5 U3.16
$1N4691: D2.1 R20.2

Pads without a net: SCREW1 1; SCREW2 1; SCREW3 1; SCREW4 1; U3 2 3 12 13 14; USB1 A8 B8

## Via types
v1: diameter 0.61, hole 0.305, Top Layer to Bottom Layer, 133 vias

## Routing (per net, layer and track width the routed paths; a pad name or vN(x,y) marks a point on that pad's centre or on a via; arc(x,y) is an arc through that point)
+3.3V: length 310.8
  Top Layer w0.203: C19.2 26.1,51.79 U1.100
  Top Layer w0.254: v1(35.5,40.96) 35.5,40.92 U1.75 ; v1(23.75,48.39) 22.22,46.86 v1(22.22,45.21) ; v1(23.75,48.39) 23.49,48.39 U1.6 ; v1(23.75,48.39) 23.75,48.62 U1.100 ; v1(20.95,43.94) 18.08,41.07 ; 18.08,41.07 U1.24 15.21,43.94 14.6,43.94 14.43,43.76 14.43,43.18 13.73,42.48 C16.2 ; 18.08,41.07 v1(23.95,35.2) 24.38,34.77 24.38,32.99 U1.49 20.61,29.21 v1(19.62,29.21) ; U1.64 29.84,37.79 v1(29.84,38.23) ; R14.2 19.46,59.65 ; R18.2 10.08,73.53 v1(10.79,73.53)
  Top Layer w0.381: R13.2 31.5,25.26 34.01,22.76 34.01,16.12 ; H2.49 40.51,11.18 35.56,16.13 34.01,16.13 34.01,16.12 ; 21.55,16.94 21.59,16.89 27.25,16.89 ; 27.25,16.89 28.07,16.07 C12.2 31.55,16.12 34.01,16.12 ; 27.25,16.89 U3.5 ; R19.2 15.68,73.45 v1(15.68,71.82) ; v1(18.41,62.61) 18.41,60.33 19.09,59.65 19.46,59.65 19.46,59.74 20.69,60.96 26.92,60.96 35.56,69.6 H2.3 ; U3.16 27.25,11.63 26.42,10.79 C5.2 ; v1(23.11,14.22) 22.42,14.91 R10.1 ; v1(36.19,51.56) 35.7,51.07 35.7,51.06 35.57,50.93 35.57,50.42
  Top Layer w0.508: v1(21.08,18.92) 21.08,18.94 ; 21.08,18.94 21.08,19.94 19.05,21.97 19.05,25.06 ; 21.08,18.94 21.55,18.47 v1(21.55,16.24) R10.1 ; v1(18.92,18.94) 15.37,15.38 v1(15.37,11.43) ; 19.05,25.06 v1(19.05,26.8) ; 19.05,25.06 18.95,25.16 LED1.2 ; v1(23.24,12.32) 23.11,12.32 22.48,11.68 20.45,11.68 19.3,10.54 19.3,7.87 19.05,7.62 v1(18.92,7.62)
  Bottom Layer w0.203: v1(23.75,48.39) C21.2
  Bottom Layer w0.254: v1(20.95,43.94) v1(22.22,45.21) ; v1(35.5,40.96) 35.12,40.58 C17.2 30.29,40.58 C18.2 29.84,38.58 v1(29.84,38.23) 29.84,37.21 28.83,36.19 24.95,36.19 v1(23.95,35.2)
  Bottom Layer w0.381: v1(15.68,71.82) 15.68,68.58 ; 15.68,68.58 10.41,68.58 10.16,68.33 ; 15.68,68.58 18.41,65.85 v1(18.41,62.61) ; 43.69,52.83 43.69,68.83 44.45,69.6 H2.3 ; 43.69,52.83 43.69,13.08 H2.49 ; 43.69,52.83 42.67,51.82 36.45,51.82 v1(36.19,51.56) ; 10.16,68.33 8.89,67.06 H3.6 ; 10.16,68.33 10.16,72.39 10.79,73.02 v1(10.79,73.53) ; L2.1 18.03,27.81 v1(19.05,26.8) 19.62,27.37 v1(19.62,29.21) ; v1(23.24,12.32) 24.64,10.92 v1(26.54,10.92)
  Bottom Layer w0.508: H2.1 H2.3 ; v1(18.92,18.94) C1.2 21.08,18.94 ; 2.41,13.72 H3.49 5.97,7.62 v1(18.92,7.62) ; v1(15.37,11.43) 14.4,11.43 C3.2 14.33,11.39 R2.2 ; v1(23.24,12.32) 23.11,12.45 v1(23.11,14.22)
  vias: v1(21.08,18.16) v1(21.97,18.92) v1(21.97,18.16)
GND: length 100.4
  Top Layer w0.203: v1(35.68,39.18) 35.53,39.18 U1.74 ; U7.1 19.62,73.54 ; 13.92,73.54 v1(13.92,75.19) v1(13.92,76.21) U6.1 13.92,78.15 13.34,78.74 10.73,78.74 C23.2 ; U1.35 17.91,36.41 v1(17.91,36.19)
  Top Layer w0.254: U1.23 15.53,44.32 13.91,44.32 C16.1 13.4,43.94 v1(12.7,43.94) ; C19.1 v1(27.5,54.86) ; C13.1 v1(28.87,26.03) ; v1(33.15,63.25) 33.79,63.25 R1.1 ; C14.2 26.75,59.93 U5.2 v1(24,59.93) v1(22.86,59.93) U5.1 ; 12.09,53.11 12.26,53.11 13.1,52.27 ; U1.63 29.72,37.21 29.46,37.21 v1(29.08,37.59) ; C12.1 31.43,14.6 v1(29.99,14.6) 27.18,14.6 26.6,14.03 26.6,12.12 26.03,11.56 25.02,11.56 24.45,10.98 C5.1 ; 16.87,53.65 16.87,53.8 ; R11.1 v1(32.13,17.66) ; U1.48 20.79,30.1 18.92,30.1 18.22,29.4 18.22,29.21 v1(16.89,29.21)
  Top Layer w0.381: USB1.1 29.59,6.86 USB1.A12 USB1.B1 ; USB1.1 21.92,7.78 USB1.B12
  Top Layer w0.508: 14.49,48.65 v1(13.71,49.44) v1(12.86,50.29) v1(12.08,51.06) 11.43,51.72 11.43,52.45 v1(11.77,52.79) v1(12.94,53.96) v1(13.82,54.84) 14.41,55.44 v1(15.23,55.44) v1(16.48,54.19) v1(17.36,53.31) 17.89,52.78 v1(17.89,52.06) ; 15.86,52.63 16.87,53.65
  Bottom Layer w0.203: v1(17.91,36.19) 17.91,36.84 C7.2
  Bottom Layer w0.254: C18.1 28.85,37.59 v1(29.08,37.59) ; v1(35.68,39.18) C17.1 ; C7.2 C6.2 15.23,35.94 U4.3 14.72,33.95 C9.1 C8.1 ; v1(17.91,36.19) 18.29,36.19 19.48,35.01 19.48,32.77
  Bottom Layer w0.508: H2.4 H2.2 ; H3.50 H3.46 H3.44 H3.42
  vias: v1(6.86,73.91) v1(8,78.36) v1(8,75.63) v1(8.13,47.88) v1(10.41,45.47) v1(13.84,25.53) v1(13.84,23.96) v1(13.84,22.39) v1(13.84,20.83) v1(14.6,29.21) v1(14.6,28.27) v1(16.9,28.27) v1(20.83,42.04) v1(20.83,40.13) v1(21.97,78.99) v1(23,42.04) v1(23.02,40.13) v1(22.99,38.23) v1(23.37,55.75) v1(23.37,53.85) v1(23.76,44.58) v1(25.23,55.75) v1(25.34,78.99) v1(25.91,46.48) v1(25.91,44.58) v1(25.91,42.8) v1(26.42,39.5) v1(26.47,37.31) v1(27.09,55.75) v1(27.86,46.48) v1(28.7,78.99) v1(29.72,43.56) v1(29.72,41.66) v1(30.73,22.1) v1(30.73,20.7) v1(31.06,6.46) v1(31.06,4.04) v1(31.06,1.78) v1(31.78,41.66) v1(32.07,78.99) v1(32.58,22.1) v1(32.58,20.7) v1(33.25,6.46) v1(33.26,1.78) v1(35.31,19.94) v1(35.31,17.4) v1(35.43,78.99) v1(35.44,6.46) v1(35.45,1.78) v1(37.59,19.94) v1(37.59,17.4) v1(37.62,6.46) v1(37.65,1.78) v1(38.8,78.99) v1(39.81,6.46) v1(39.84,1.78) v1(42,6.46) v1(42.04,4.19) v1(42.04,1.78) v1(42.16,78.99)
VBUS: length 85
  Top Layer w0.381: v1(14.35,18.41) 17.02,18.41 18.19,19.59 19.64,19.59 19.94,19.29 19.94,18.64 17.14,15.84 v1(17.14,13.97)
  Top Layer w0.508: 22.82,7.78 22.82,8.87 22.75,8.94 ; v1(20.19,9.43) 22.26,9.43 22.73,8.96 ; 27.72,7.78 v1(27.72,9.28)
  Bottom Layer w0.381: v1(14.35,18.41) 14.35,17.22 U2.1
  Bottom Layer w0.508: 12.76,22.55 12.76,21.02 9.78,18.03 9.78,12.32 12.67,9.43 17.92,9.43 ; 12.76,22.55 C8.2 C9.2 12.76,34.94 U4.1 ; 12.76,22.55 12.71,22.61 3.68,22.61 H3.41 H3.43 H3.45 ; C4.2 18.19,10.24 18.11,10.16 22.99,10.16 23.87,9.28 v1(27.72,9.28) ; v1(20.19,9.43) 17.92,9.43 ; 17.92,9.43 D1.1
BOOT0: length 33
  Top Layer w0.203: 35.64,62.61 35.64,63.41 R1.2 ; 35.64,62.61 44.74,62.61 45.16,63.03 46.03,63.03 46.45,62.61 46.99,62.61 48.13,63.75 H2.8 ; 35.64,62.61 32.38,62.61 29.59,59.82 29.59,50.92 U1.95
CC1: length 3.1
  Top Layer w0.254: USB1.A5 v1(24.02,5.84)
  Bottom Layer w0.254: v1(24.02,5.84) 24.02,4.73 R17.1
CC2: length 3.1
  Top Layer w0.254: USB1.B5 v1(27.02,6.48)
  Bottom Layer w0.254: v1(27.02,6.48) 27.02,4.74 R16.1
D_PA2: length 5.6
  Top Layer w0.203: U3.8 25.3,21.18 23.88,22.6 R3.2
D_PA3: length 6
  Top Layer w0.203: R4.2 22.25,22.45 24.65,20.05 U3.9
D_PA4: length 6.4
  Top Layer w0.203: R15.2 20.62,23.19 24,19.82 U3.10
D_PA5: length 2.6
  Top Layer w0.203: LED2.1 23.66,13.22 U3.11
D_SWCLK: length 5.2
  Top Layer w0.203: U3.7 25.95,21.93 25.51,22.37 R8.2
D_SWDIO: length 5.2
  Top Layer w0.203: R9.2 27.05,23.54 27.05,22.35 26.6,21.9 26.6,18.62
DAP_BOOT0: length 1.7
  Top Layer w0.203: R11.2 30.4,19.17 U3.1
DAP_D+: length 9
  Top Layer w0.254: USB1.A6 25.02,6.85 25.15,6.73 25.78,6.73 26.02,6.97 USB1.B6 26.02,8.58 28.55,11.1 U3.18
DAP_D-: length 8.3
  Top Layer w0.254: USB1.B7 24.52,8.79 24.76,9.03 25.27,9.03 25.52,8.78 ; 25.52,8.78 USB1.A7 ; 25.52,8.78 25.52,8.89 27.9,11.26 U3.17
DAP_NRST: length 7.3
  Top Layer w0.203: U3.4 27.9,20.66 28.87,21.63 C13.2 30.59,23.74 R13.1
KEY_1: length 43.5
  Top Layer w0.203: 21.56,48.9 20.7,49.76 20.7,50.93 7.11,64.52 H3.8 ; U6.3 10.57,76.64 C23.1 10.03,75 R18.1 10.35,74.96 11.77,73.54 11.77,68.54 v1(10.16,66.93)
  Bottom Layer w0.203: v1(10.16,66.93) 7.75,64.52 H3.8
KEY_2: length 52.2
  Top Layer w0.203: v1(20.1,50.39) 20.1,49.66 U1.9 ; 17.47,77.84 16.27,76.64 C24.1 15.71,74.98 R19.1 17.12,73.54 17.47,73.54 ; v1(13.59,57.02) 13.59,57.53 8,63.12 3.56,63.12 H3.9
  Top Layer w0.254: 17.47,73.54 17.47,72.33 13.59,68.45 v1(13.59,63.25)
  Bottom Layer w0.203: v1(20.1,50.39) 20.1,53.44 16.51,57.02 v1(13.59,57.02) v1(13.59,63.25)
MCU_CLK: length 4.6
  Top Layer w0.203: H1.1 34.37,12.88 U3.20
MCU_DIO: length 7.1
  Top Layer w0.203: H1.2 30.35,10.29 29.2,11.44 29.2,12.88
NRST: length 46.3
  Top Layer w0.203: U1.14 v1(20.45,45.77) 24.89,41.33 24.89,32.57 24.9,32.56 24.9,30.99 20.62,26.72 R15.1
  Top Layer w0.254: U5.3 20.81,58.05 R14.1 ; U5.3 U5.4 26.61,57.78 C14.1 ; U5.3 21.72,57.14 v1(21.72,55.63)
  Bottom Layer w0.203: v1(21.72,55.63) 21.72,47.03 v1(20.45,45.77)
OSC_IN: length 9.2
  Top Layer w0.203: 14.66,53.83 14.66,52.4 15.99,51.07 C22.2 16.9,50.73 U1.12
OSC_OUT: length 7.3
  Top Layer w0.203: 19.79,47.14 17.91,49.02 16.1,49.02 15.48,49.64 15.48,49.89 14.3,51.07
PA0: length 18.8
  Top Layer w0.203: H3.17 3.56,52.96 6.3,52.96 13.59,45.67 16.31,45.67 U1.20
PA1: length 15.1
  Top Layer w0.203: H3.18 7.01,51.82 13.49,45.34 15.93,45.34 U1.21
PA2: length 17.5
  Top Layer w0.203: U1.22 15.61,44.96 13.44,44.96 7.85,50.55 4.06,50.55 2.79,49.28 H3.19
PA3: length 15.2
  Top Layer w0.203: U1.25 13.55,40.89 12.83,40.89 4.95,48.77 H3.20
PA4: length 17.1
  Top Layer w0.203: H3.21 3.56,47.88 5.38,47.88 13.39,39.88 15.01,39.88 U1.26
PA5: length 14.4
  Top Layer w0.203: H3.22 6.1,46.74 13.59,39.24 15.08,39.24 U1.27
PA6: length 17.5
  Top Layer w0.203: H3.23 3.56,45.34 6.86,45.34 13.46,38.73 15.28,38.73 U1.28
PA7: length 14.6
  Top Layer w0.203: H3.24 6.73,44.2 12.7,38.23 15.48,38.23 16.61,39.36
PA8: length 18.1
  Top Layer w0.203: H2.32 46.86,32.77 38.41,32.77 U1.69
PA9: length 14.3
  Top Layer w0.203: H2.31 37.84,34.04 U1.70
PA10: length 16.5
  Top Layer w0.203: H2.30 46.99,35.43 37.15,35.43 U1.71
PA11: length 12.8
  Top Layer w0.203: 33.94,39.36 36.72,36.58 H2.29
PA12: length 15
  Top Layer w0.203: U1.73 36.03,37.97 46.99,37.97 H2.28
PA13: length 33.7
  Top Layer w0.203: H2.27 41.91,39.12 37.47,43.56 35.66,43.56 U1.76 31.88,39.77 v1(31.88,39.37) ; R9.1 27.14,28.03 v1(27.5,28.38)
  Bottom Layer w0.203: v1(27.5,28.38) 31.88,32.77 v1(31.88,39.37)
PA14: length 37.7
  Top Layer w0.203: R8.1 25.51,27.67 v1(27.11,29.27) ; H2.26 46.86,40.39 41.4,40.39 37.85,43.94 35.34,43.94 U1.77 31.12,39.72 v1(31.12,38.99)
  Bottom Layer w0.203: v1(31.12,38.99) 31.12,33.27 v1(27.11,29.27)
PA15: length 12.7
  Top Layer w0.203: U1.78 34.33,43.6 35.05,44.32 38.35,44.32 41.02,41.66 H2.25
PB0: length 17.9
  Top Layer w0.203: H3.27 3.68,40.39 7.24,40.39 10.79,36.83 16.2,36.83 U1.32
PB1: length 14.9
  Top Layer w0.203: U1.33 16.4,36.32 10.29,36.32 7.49,39.12 H3.28
PB2: length 18
  Top Layer w0.203: H3.29 3.56,37.72 8.25,37.72 10.16,35.81 16.6,35.81 U1.34
PB3: length 23
  Top Layer w0.203: H2.13 32.77,56.9 32,56.13 32,49.8 U1.90
PB4: length 27.5
  Top Layer w0.203: H2.12 46.86,58.17 32.13,58.17 31.62,57.66 31.62,50.13 U1.91
PB5: length 25.1
  Top Layer w0.203: H2.11 32.77,59.44 31.12,57.78 31.12,50.33 U1.92
PB6: length 29
  Top Layer w0.203: H2.10 46.86,60.71 33.15,60.71 30.61,58.17 30.61,50.53 U1.93
PB7: length 26.9
  Top Layer w0.203: H2.9 33.4,61.98 30.1,58.67 30.1,50.72 U1.94
PB9: length 28.9
  Top Layer w0.203: H2.7 33.53,64.52 29.08,60.07 29.08,51.12 U1.96
PB10: length 24.7
  Top Layer w0.203: 22.97,32.99 20.46,30.48 14.35,30.48 9.78,25.91 6.6,25.91 5.84,25.15 3.05,25.15 2.41,24.51 H3.39
PB11: length 22.4
  Top Layer w0.203: U1.50 19.66,27.56 12.32,27.56 8.64,23.88 H3.40
PB12: length 30.9
  Top Layer w0.203: 48.13,13.72 46.99,12.57 44.58,12.57 43.81,13.34 43.81,14.63 U1.51
PB13: length 26.4
  Top Layer w0.203: U1.52 45.43,13.72 45.59,13.72
PB14: length 28.6
  Top Layer w0.203: U1.53 44.75,15.11 46.99,15.11 H2.46
PB15: length 25
  Top Layer w0.203: 27.57,32.99 44.31,16.26 H2.45
PC0: length 22.3
  Top Layer w0.203: H3.12 7.11,59.44 9.53,57.02 9.53,52.32 14.48,47.37 18.14,47.37 U1.15
PC1: length 24.1
  Top Layer w0.203: H3.13 3.56,58.04 7.37,58.04 9.14,56.26 9.14,52.2 14.28,47.07 17.74,47.07 U1.16
PC2: length 20.2
  Top Layer w0.203: H3.14 7.62,56.9 8.76,55.75 8.76,52.07 14.1,46.74 17.36,46.74 U1.17
PC3: length 22.2
  Top Layer w0.203: H3.15 3.56,55.5 8,55.5 8.38,55.12 8.38,51.82 13.84,46.35 17.04,46.35 18.03,45.37
PC4: length 17.6
  Top Layer w0.203: U1.30 15.81,37.85 12.19,37.85 7.24,42.8 3.56,42.8 H3.25
PC5: length 14.7
  Top Layer w0.203: H3.26 7.11,41.66 11.43,37.34 16,37.34 U1.31
PC6: length 21
  Top Layer w0.203: H2.36 46.86,27.69 40.66,27.69 U1.65
PC7: length 17.2
  Top Layer w0.203: U1.66 40.09,28.96 H2.35
PC8: length 19.5
  Top Layer w0.203: 32.17,37.59 39.53,30.23 46.86,30.23 H2.34
PC9: length 15.7
  Top Layer w0.203: 32.52,37.94 38.97,31.5 H2.33
PC10: length 15.8
  Top Layer w0.203: H2.24 46.86,42.93 41.4,42.93 39.62,44.7 34.69,44.7 33.94,43.95
PC11: length 12.7
  Top Layer w0.203: H2.23 42.54,44.2 41.66,45.08 34.36,45.08 U1.80
PC12: length 16
  Top Layer w0.203: U1.81 34.41,45.85 44.32,45.85 44.58,45.59 46.99,45.59 H2.22
PC13: length 27.6
  Top Layer w0.203: U1.7 21.21,49.96 21.21,50.93 6.48,65.66 3.17,65.66 2.41,64.9 H3.7
PD0: length 13.4
  Top Layer w0.203: U1.82 34.6,46.74 H2.21
PD1: length 17.2
  Top Layer w0.203: 32.52,45.37 35.03,47.88 46.74,47.88 H2.20
PD2: length 16.7
  Top Layer w0.254: 32.17,45.72 34.96,48.51 v1(35.31,48.51) 44.83,48.51 H2.19
  Bottom Layer w0.254: v1(35.31,48.51) 35.44,48.65 R20.1
PD3: length 21.2
  Top Layer w0.203: U1.85 34.42,48.68 34.42,50.67 35.94,52.2 40.26,52.2 41.85,50.61 46.93,50.61 H2.18
PD4: length 18.3
  Top Layer w0.203: H2.17 42.54,51.82 41.66,52.7 35.69,52.7 34.04,51.05 34.04,49 U1.86
PD5: length 47.6
  Top Layer w0.203: H2.16 46.99,53.21 33.91,53.21 33.4,52.7 33.4,49.08 U1.87 25.27,40.95 25.27,30.1 22.25,27.08 R4.1
PD6: length 44.9
  Top Layer w0.203: v1(27.11,41.97) 25.65,40.51 25.65,29.08 23.88,27.31 R3.1 ; v1(27.11,43.69) 27.31,43.69 32.89,49.28 32.89,52.83 34.42,54.36 H2.15
  Bottom Layer w0.203: v1(27.11,41.97) v1(27.11,43.69)
PD7: length 24.8
  Top Layer w0.203: H2.14 46.99,55.75 33.27,55.75 32.51,54.99 32.51,49.6 U1.89
PD8: length 27.2
  Top Layer w0.203: U1.55 43.62,17.65 46.99,17.65 H2.44
PD9: length 23.5
  Top Layer w0.203: H2.43 43.18,18.8 28.28,33.7 U1.56
PD10: length 25.7
  Top Layer w0.203: U1.57 42.49,20.19 46.99,20.19 H2.42
PD11: length 22
  Top Layer w0.203: 28.98,34.41 42.06,21.34 H2.41
PD12: length 24.3
  Top Layer w0.203: 29.34,34.76 41.37,22.73 46.99,22.73 H2.40
PD13: length 20.6
  Top Layer w0.203: H2.39 40.93,23.88 U1.60
PD14: length 22.9
  Top Layer w0.203: H2.38 46.86,25.15 40.37,25.15 U1.61
PD15: length 19.1
  Top Layer w0.203: U1.62 39.81,26.42 H2.37
PE0: length 32.8
  Top Layer w0.203: 27.57,50.32 28.57,51.32 28.57,60.33 33.53,65.28 44.45,65.28 44.96,65.79 46.86,65.79 H2.6
PE1: length 30.6
  Top Layer w0.203: H2.5 34.29,67.06 28.19,60.96 28.19,51.65 U1.98
PE2: length 34.5
  Top Layer w0.203: H3.1 2.41,72.77 2.92,73.28 7.24,73.28 9.14,71.37 9.14,66.27 U1.1
PE3: length 30.2
  Top Layer w0.203: U1.2 8.51,66.2 8.51,70.87 7.24,72.14 H3.2
PE4: length 31.1
  Top Layer w0.203: H3.3 3.56,70.74 5.72,70.74 7.75,68.71 7.75,66.24 15.7,58.29 15.71,58.29 U1.3
PE5: length 27.4
  Top Layer w0.203: U1.4 7.24,66.05 7.24,68.45 6.1,69.6 H3.4
PE6: length 29.5
  Top Layer w0.203: H3.5 3.68,68.33 6.22,68.33 6.86,67.69 6.86,65.73 U1.5
PE7: length 16.5
  Top Layer w0.203: 19.79,36.18 18.03,34.42 8.64,34.42 6.48,36.58 H3.30
PE8: length 19.4
  Top Layer w0.203: U1.39 18.36,34.04 7.87,34.04 6.73,35.18 3.56,35.18 H3.31
PE9: length 16.6
  Top Layer w0.203: U1.40 18.56,33.53 5.46,33.53 H3.32
PE10: length 19.9
  Top Layer w0.203: U1.41 18.63,32.89 3.81,32.89 H3.33
PE11: length 17.6
  Top Layer w0.203: 21.21,34.76 19.03,32.59 10.74,32.59 9.65,31.5 H3.34
PE12: length 21.4
  Top Layer w0.203: 21.56,34.41 19.28,32.13 11.18,32.13 9.27,30.23 3.68,30.23 H3.35
PE13: length 19.1
  Top Layer w0.203: U1.44 19.61,31.75 11.81,31.75 9.02,28.96 H3.36
PE14: length 22.9
  Top Layer w0.203: U1.45 19.81,31.24 12.95,31.24 9.4,27.69 3.68,27.69 H3.37
PE15: length 20.5
  Top Layer w0.203: U1.46 20.13,30.86 13.46,30.86 9.02,26.42 H3.38
PF2: length 16.6
  Top Layer w0.203: H3.16 5.46,53.85 5.84,53.85 13.72,45.97 16.58,45.97 17.53,45.01 U1.19
PF9: length 23.7
  Top Layer w0.203: v1(19.43,51.18) 19.43,49.62 U1.10 ; H3.10 7.62,61.98 v1(11.43,58.17)
  Bottom Layer w0.203: v1(11.43,58.17) 11.43,58.14 13.1,56.46 16.18,56.46 19.43,53.21 v1(19.43,51.18)
PF10: length 26.1
  Top Layer w0.203: U1.11 18.8,49.55 v1(18.8,50.29) ; v1(12.32,56.39) 8,60.71 3.68,60.71 H3.11
  Bottom Layer w0.203: v1(18.8,50.29) 18.8,53.21 15.88,56.13 12.57,56.13 v1(12.32,56.39)
VREF+: length 7
  Top Layer w0.203: U1.36 v1(19.99,37.79)
  Bottom Layer w0.254: R12.2 16.15,38.35 C6.1 C7.1 19.48,38.31 v1(19.99,37.79)
$1N1911: length 1.7
  Top Layer w0.508: R5.2 17.08,23.61 LED1.1
$1N1933: length 1.7
  Top Layer w0.203: R10.2 20.04,13.3 LED2.2
$1N2083: length 1.6
  Bottom Layer w0.203: U4.2 12.96,37.14 R12.1
$1N2090: length 6.1
  Top Layer w0.203: U1.37 18.34,35.43 v1(18.13,35.43)
  Bottom Layer w0.203: v1(18.13,35.43) 18.08,35.38 C11.2
  Bottom Layer w0.254: L2.2 18.08,31.22 C10.2 C11.2
$1N4691: length 1.7
  Top Layer w0.254: D2.1 v1(37.85,50.3)
  Bottom Layer w0.254: v1(37.85,50.3) 36.96,50.3 R20.2
$1N10377: length 1.7
  Bottom Layer w0.508: L1.2 16.31,18.51 U2.3
$1N10666: length 1.6
  Bottom Layer w0.508: R7.2 R6.1

## Copper pours and planes (outline as drawn; the poured copper is in the pictures)
GND on Top Layer: 15.93,53.83 17.05,53.83 17.05,52.7 15.93,52.7
GND on Top Layer: -3.18,82.42 57.02,82.42 57.02,-1.65 -3.18,-1.65
GND on Bottom Layer: -17.02,88.14 61.21,88.14 61.21,-8.13 -17.02,-8.13

Small or netless copper shapes (teardrops, artwork), in the pictures only: 281 on Top Layer, 130 on Bottom Layer

## Text on the board
Bottom Silkscreen Layer: CLK | DIO | 5V | 3V3 | E2 | E4 | E6 | C13 | C15 | F10 | C1 | C3 | A0 | A2 | A4 | A6 | C4 | B0 | B2 | E8 | E10 | E12 | E14 | B10 | G | E3 | E5 | C14 | F9 | C0 | C2 | F2 | A1 | A3 | A5 | A7 | C5 | B1 | E7 | E9 | E11 | E13 | E15 | B11 | E1 | B9 | B7 | B5 | B3 | D6 | D4 | D2 | D0 | C11 | A15 | A13 | A11 | A9 | C9 | C7 | D15 | D13 | D11 | D9 | B15 | B13 | E0 | B8 | B6 | B4 | D7 | D5 | D3 | D1 | C12 | C10 | A14 | A12 | A10 | A8 | C8 | C6 | D14 | D12 | D10 | D8 | B14 | B12
Top Silkscreen Layer: C15 | C14 | RST | CLK | DIO | E2 | E4 | E6 | C13 | F10 | C1 | C3 | A0 | A2 | A4 | A6 | C4 | B0 | B2 | E8 | E10 | E12 | E14 | B10 | 5V | 3V3 | E3 | E5 | F9 | C0 | C2 | F2 | A1 | A3 | A5 | A7 | C5 | B1 | E7 | E9 | E11 | E13 | E15 | B11 | GND | E1 | B9 | B7 | B5 | B3 | D6 | D4 | D2 | D0 | C11 | A15 | A13 | A11 | A9 | C9 | C7 | D15 | D13 | D11 | D9 | B15 | B13 | E0 | B8 | B6 | B4 | D7 | D5 | D3 | D1 | C12 | C10 | A14 | A12 | A10 | A8 | C8 | C6 | D14 | D12 | D10 | D8 | B14 | B12
